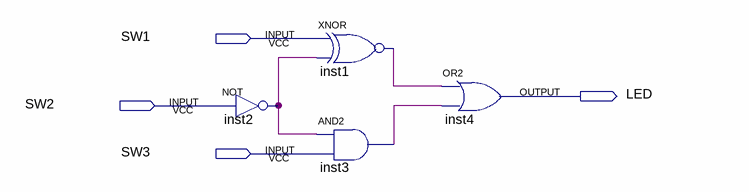
[diagram p0: schematic sheet]
// Quartus schematic Block1.bdf as structural Verilog: 4 symbols, 4 pins
module Block1 (
  input  SW1,
  input  SW2,
  input  SW3,
  output LED
);

  wire inst1_out, inst2_out, inst3_out;

  not inst2 (inst2_out, SW2);
  xnor inst1 (inst1_out, SW1, inst2_out);
  and inst3 (inst3_out, inst2_out, SW3);
  or inst4 (LED, inst1_out, inst3_out);
endmodule
